# Altium schematic sheet MotorBoard.SchDoc: Set in Document Options » Parameters » Title
size A4; Author: Set in Document Options » Parameters » Author + Contact info
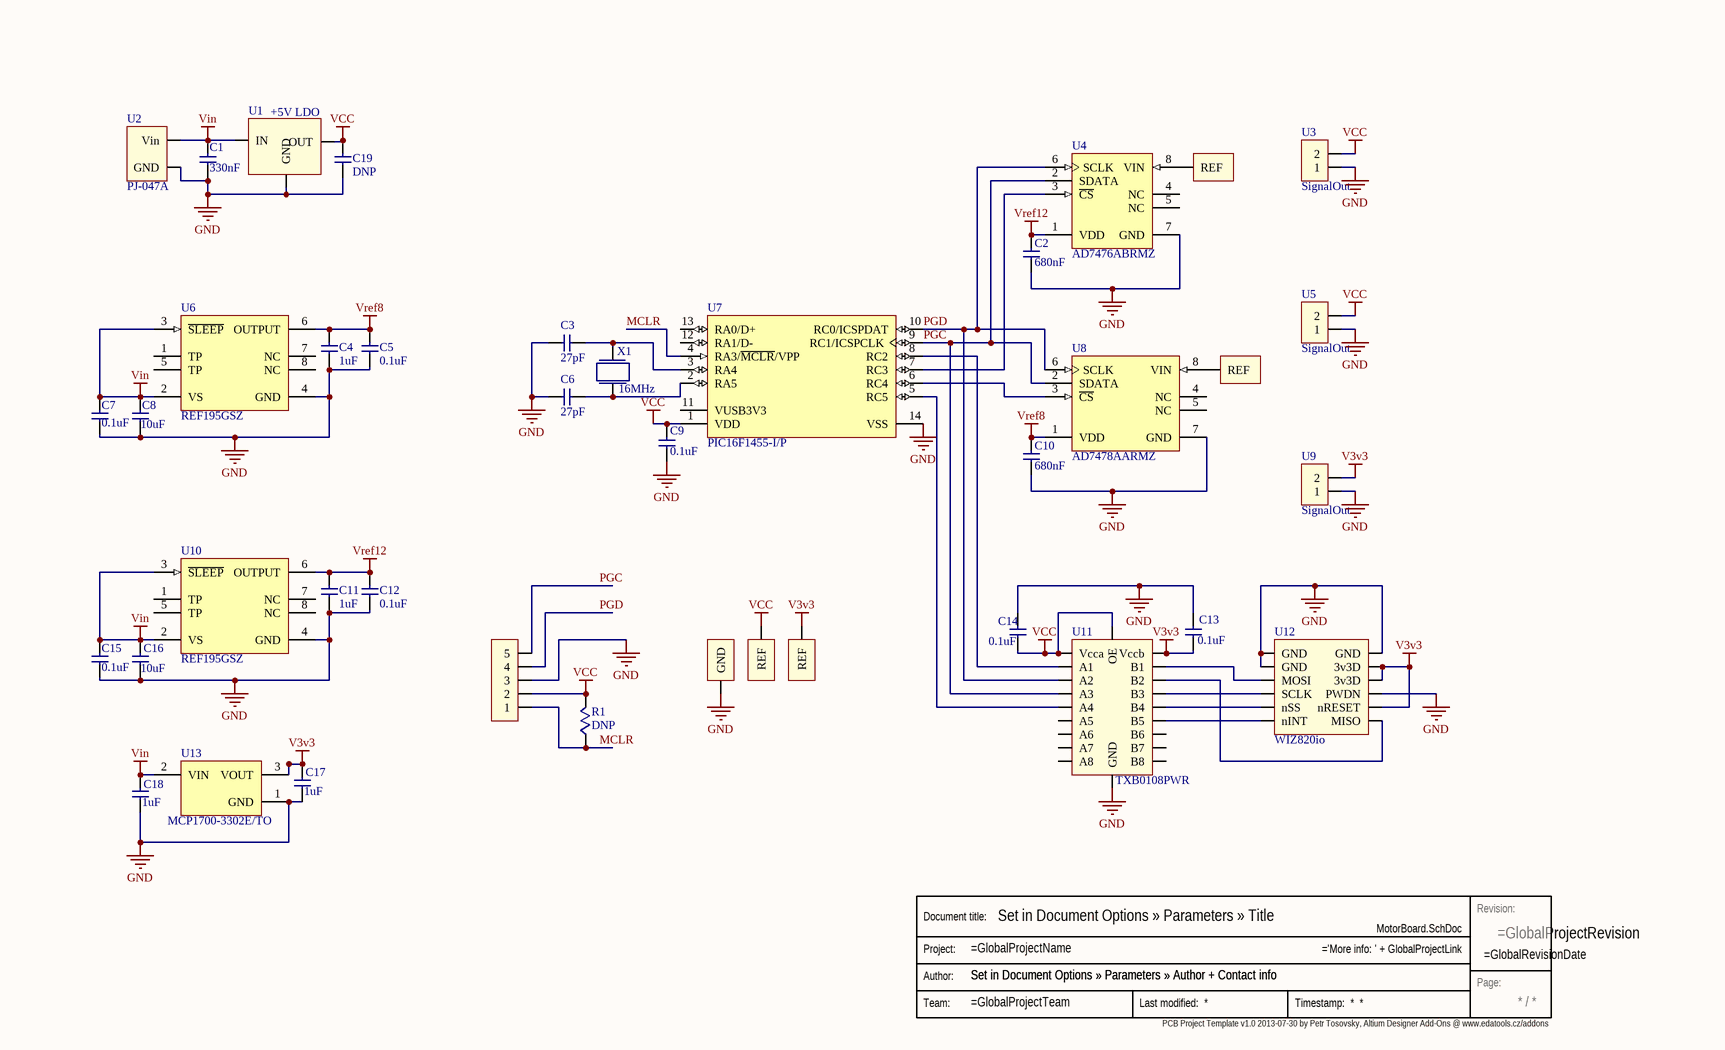
[diagram p0: MotorBoard.SchDoc]

## Parts
C1  330nF  [FK18/24 Capacitor]
C2  680nF  [FK26/16 Capacitor]
C3  27pF  [FK18/24 Capacitor]
C4  1uF  [FK18/24 Capacitor]
C5  0.1uF  [FK26/16 Capacitor]
C6  27pF  [FK18/24 Capacitor]
C7  0.1uF  [FK26/16 Capacitor]
C8  10uF  [FK26/16 Capacitor]
C9  0.1uF  [FK26/16 Capacitor]
C10  680nF  [FK26/16 Capacitor]
C11  1uF  [FK18/24 Capacitor]
C12  0.1uF  [FK26/16 Capacitor]
C13  0.1uF  [FK26/16 Capacitor]
C14  0.1uF  [FK26/16 Capacitor]
C15  0.1uF  [FK26/16 Capacitor]
C16  10uF  [FK26/16 Capacitor]
C17  1uF  [FK18/24 Capacitor]
C18  1uF  [FK18/24 Capacitor]
C19  DNP  [FK26/16 Capacitor]
R1  DNP  [Axial 0.5]
Stamp  Stamp  (value not drawn)  (graphical)
U1  +5V LDO  [MC7805CTG]
U2  PJ-047A  [PJ-047A]
U3  SignalOut  [SignalOut]
U4  AD7476ABRMZ  [RM-8_L]
U5  SignalOut  [SignalOut]
U6  REF195GSZ  [ADI-R-8_L]
U7  PIC16F1455-I/P  [MCHP-PDIP-P14]
U8  AD7478AARMZ  [RM-8_L]
U9  SignalOut  [SignalOut]
U10  REF195GSZ  [ADI-R-8_L]
U11  TXB0108PWR  [TSOP65P640X120-20N]
U12  WIZ820io  [WIZ5200]
U13  MCP1700-3302E/TO  [TO-92-TO3]
U14  Ref  [Ground]  (value not drawn)
U15  Ref  [Ground]  (value not drawn)
U16  Ground  [Ground]  (value not drawn)
U17  ProgrammingHeader  [ProgrammingHeader]  (value not drawn)
U18  Ref  [Ground]  (value not drawn)
U19  Ref  [Ground]  (value not drawn)
X1  16MHz  [9B-16.000MEEJ-B]

## Nets
GND: C1.1 C2.1 C3.1 C4.1 C5.1 C6.1 C7.1 C8.1 C9.1 C10.1 C11.1 C12.1 C13.1 C14.2 C15.1 C16.1 C17.1 C18.1 C19.1 U1.2(GND) U2.2(GND) U3.1 U4.7(GND) U5.1 U6.4(GND) U7.14(VSS) U8.7(GND) U9.1 U10.4(GND) U11.11(GND) U12.1(GND) U12.2(GND) U12.9(PWDN) U12.12(GND) U13.1(GND) U16.1(GND) U17.3
V3v3: C13.2 C17.2 U9.2 U11.19(Vccb) U12.8(nRESET) U12.10(3v3D) U12.11(3v3D) U13.3(VOUT) U15.1(REF)
VCC: C9.2 C14.1 C19.2 R1.2 U1.3(OUT) U3.2 U5.2 U7.1(VDD) U11.2(Vcca) U11.10(OE) U14.1(REF) U17.2
Vin: C1.2 C7.2 C8.2 C15.2 C16.2 C18.2 U1.1(IN) U2.1(Vin) U6.2(VS) U6.3(~{SLEEP}) U10.2(VS) U10.3(~{SLEEP}) U13.2(VIN)
Vref8: C4.2 C5.2 C10.2 U6.6(OUTPUT) U8.1(VDD)
Vref12: C2.2 C11.2 C12.2 U4.1(VDD) U10.6(OUTPUT)
MCLR: R1.1 U7.4(RA3/~{MCLR}/VPP) U17.1
PGC: U4.2(SDATA) U7.9(RC1/ICSPCLK) U8.2(SDATA) U11.4(A3) U17.5
PGD: U4.6(SCLK) U7.10(RC0/ICSPDAT) U8.6(SCLK) U11.3(A2) U17.4
NetC3_2: C3.2 U7.3(RA4) X1.2
NetC6_2: C6.2 U7.2(RA5) X1.1
NetU4_3: U4.3(~{CS}) U7.7(RC3)
NetU4_8: U4.8(VIN) U18.1(REF)
NetU7_5: U7.5(RC5) U11.5(A4)
NetU7_6: U7.6(RC4) U8.3(~{CS})
NetU7_8: U7.8(RC2) U11.1(A1)
NetU8_8: U8.8(VIN) U19.1(REF)
NetU11_15: U11.15(B5) U12.6(nINT)
NetU11_16: U11.16(B4) U12.5(nSS)
NetU11_17: U11.17(B3) U12.4(SCLK)
NetU11_18: U11.18(B2) U12.7(MISO)
NetU11_20: U11.20(B1) U12.3(MOSI)

Not connected (* = marked no-connect by the designer): U4 4(NC) 5(NC); U6 1(TP) 5(TP) 7(NC) 8(NC); U7 11(VUSB3V3) 12(RA1/D-) 13(RA0/D+); U8 4(NC) 5(NC); U10 1(TP) 5(TP) 7(NC) 8(NC); U11 6(A5) 7(A6) 8(A7) 9(A8) 12(B8) 13(B7) 14(B6)

## Notes on the sheet
- PCB Project Template v1.0 2013-07-30 by Petr Tosovsky, Altium Designer Add-Ons @ www.edatools.cz/addons <http://www.edatools.cz/addons>
- (in symbol Stamp) Revision:; Document title:; Project:; Author:; Page:; Team:

## Library data of the parts
C1 = FK24X7R1H334K: CAP CER 0.33UF 50V 10% RADIAL; Manufacturer: TDK Corporation; Capacitance: 0.33µF; Temperature Coefficient: X7R; Supplier 1: Digi-Key; Manufacturer Part Number: FK24X7R1H334K; RoHS: RoHS Compliant; Category: Capacitors; Stock 1: 7845; Pricing 1: 1=0.32, 10=0.222, 100=0.1333, 250=0.11112, 500=0.1, 1000=0.08444, 5000=0.07555, 10000=0.0711, 25000=0.06666 (USD); Packaging: Bulk; Tolerance: ±10%; Voltage - Rated: 50V; Mounting Type: Through Hole; Operating Temperature: -55°C ~ 125°C; Applications: General Purpose; Ratings: -; Package / Case: Radial; Size / Dimension: 0.217" L x 0.177" W (5.50mm x 4.50mm); Height - Seated (Max): 0.217" (5.50mm); Thickness (Max): -; Lead Spacing: 0.197" (5.00mm); Features: -; Lead Style: Formed Leads - Kinked; ComponentLink1URL: http://product.tdk.com/capacitor/leadmlcc/en/documents/leadmlcc_commercial_general_en.pdf; ComponentLink1Description: http://product.tdk.com/capacitor/leadmlcc/en/documents/leadmlcc_commercial_general_en.pdf; Supplier Part Number 1: 445-5263-ND
C2 C10 = FK26X7R1H684K: CAP CER 0.68UF 50V 10% RADIAL; Manufacturer: TDK Corporation; Capacitance: 0.68µF; Temperature Coefficient: X7R; Supplier 1: Digi-Key; Manufacturer Part Number: FK26X7R1H684K; RoHS: RoHS Compliant; Category: Capacitors; Stock 1: 1174; Pricing 1: 1=0.45, 10=0.312, 100=0.187, 250=0.15584, 500=0.14024, 1000=0.11611, 5000=0.10389, 10000=0.09778, 25000=0.09167 (USD); Packaging: Bulk; Tolerance: ±10%; Voltage - Rated: 50V; Mounting Type: Through Hole; Operating Temperature: -55°C ~ 125°C; Applications: General Purpose; Ratings: -; Package / Case: Radial; Size / Dimension: 0.217" L x 0.138" W (5.50mm x 3.50mm); Height - Seated (Max): 0.236" (6.00mm); Thickness (Max): -; Lead Spacing: 0.197" (5.00mm); Features: -; Lead Style: Formed Leads - Kinked; ComponentLink1URL: http://product.tdk.com/capacitor/leadmlcc/en/documents/leadmlcc_commercial_general_en.pdf; ComponentLink1Description: http://product.tdk.com/capacitor/leadmlcc/en/documents/leadmlcc_commercial_general_en.pdf; Supplier Part Number 1: 445-8560-ND
C3 C6 = FK18C0G1H270J: CAP CER 27PF 50V 5% RADIAL; Manufacturer: TDK Corporation; Temperature Coefficient: C0G, NP0; Supplier 1: Digi-Key; Manufacturer Part Number: FK18C0G1H270J; RoHS: RoHS Compliant; Category: Capacitors; Stock 1: 2293; Pricing 1: 1=0.29, 10=0.2, 100=0.1133, 250=0.09, 500=0.08, 1000=0.06999, 5000=0.06166, 10000=0.05833, 25000=0.05333 (USD); Packaging: Bulk; Capacitance: 27pF; Tolerance: ±5%; Voltage - Rated: 50V; Mounting Type: Through Hole; Operating Temperature: -55°C ~ 125°C; Applications: General Purpose; Ratings: -; Package / Case: Radial; Size / Dimension: 0.157" L x 0.098" W (4.00mm x 2.50mm); Height - Seated (Max): 0.217" (5.50mm); Thickness (Max): -; Lead Spacing: 0.098" (2.50mm); Features: -; Lead Style: Formed Leads - Kinked; ComponentLink1URL: http://product.tdk.com/capacitor/leadmlcc/en/documents/leadmlcc_commercial_general_en.pdf; ComponentLink1Description: http://product.tdk.com/capacitor/leadmlcc/en/documents/leadmlcc_commercial_general_en.pdf; Supplier Part Number 1: 445-4764-ND
C4 C11 C17 C18 = FK24X7R1H105K: CAP CER 1UF 50V 10% RADIAL; Manufacturer: TDK Corporation; Capacitance: 1µF; Temperature Coefficient: X7R; Supplier 1: Digi-Key; Manufacturer Part Number: FK24X7R1H105K; RoHS: RoHS Compliant; Category: Capacitors; Stock 1: 21684; Pricing 1: 1=0.4, 10=0.278, 100=0.1667, 250=0.13892, 500=0.12502, 1000=0.10556, 5000=0.09445, 10000=0.0889, 25000=0.08334 (USD); Packaging: Bulk; Tolerance: ±10%; Voltage - Rated: 50V; Mounting Type: Through Hole; Operating Temperature: -55°C ~ 125°C; Applications: General Purpose; Ratings: -; Package / Case: Radial; Size / Dimension: 0.177" L x 0.098" W (4.50mm x 2.50mm); Height - Seated (Max): 0.217" (5.50mm); Thickness (Max): -; Lead Spacing: 0.197" (5.00mm); Features: -; Lead Style: Formed Leads - Kinked; ComponentLink1URL: http://product.tdk.com/capacitor/leadmlcc/en/documents/leadmlcc_commercial_general_en.pdf; ComponentLink1Description: http://product.tdk.com/capacitor/leadmlcc/en/documents/leadmlcc_commercial_general_en.pdf; Supplier Part Number 1: 445-8517-ND
C5 C7 C9 C12-C15 = FK26X7R2A104K: CAP CER 0.1UF 100V 10% RADIAL; Manufacturer: TDK Corporation; Capacitance: 0.1µF; Temperature Coefficient: X7R; Supplier 1: Digi-Key; Manufacturer Part Number: FK26X7R2A104K; RoHS: RoHS Compliant; Category: Capacitors; Stock 1: 28932; Pricing 1: 1=0.44, 10=0.306, 100=0.1833, 250=0.15276, 500=0.1375, 1000=0.11611, 5000=0.10389, 10000=0.09778, 25000=0.09167 (USD); Packaging: Bulk; Tolerance: ±10%; Voltage - Rated: 100V; Mounting Type: Through Hole; Operating Temperature: -55°C ~ 125°C; Applications: General Purpose; Ratings: -; Package / Case: Radial; Size / Dimension: 0.217" L x 0.138" W (5.50mm x 3.50mm); Height - Seated (Max): 0.236" (6.00mm); Thickness (Max): -; Lead Spacing: 0.197" (5.00mm); Features: -; Lead Style: Formed Leads - Kinked; ComponentLink1URL: http://product.tdk.com/capacitor/leadmlcc/en/documents/leadmlcc_commercial_midvoltage_en.pdf; ComponentLink1Description: http://product.tdk.com/capacitor/leadmlcc/en/documents/leadmlcc_commercial_midvoltage_en.pdf; Supplier Part Number 1: 445-2634-ND
C8 C16 = FK16X7R1C106K: CAP CER 10UF 16V 10% RADIAL; Manufacturer: TDK Corporation; Capacitance: 10µF; Temperature Coefficient: X7R; Supplier 1: Digi-Key; Manufacturer Part Number: FK16X7R1C106K; RoHS: RoHS Compliant; Category: Capacitors; Stock 1: 9327; Pricing 1: 1=0.46, 10=0.325, 100=0.2142, 250=0.18248, 500=0.15868, 1000=0.13223, 5000=0.11667, 10000=0.10889, 25000=0.105 (USD); Packaging: Bulk; Tolerance: ±10%; Voltage - Rated: 16V; Mounting Type: Through Hole; Operating Temperature: -55°C ~ 125°C; Applications: General Purpose; Ratings: -; Package / Case: Radial; Size / Dimension: 0.217" L x 0.138" W (5.50mm x 3.50mm); Height - Seated (Max): 0.236" (6.00mm); Thickness (Max): -; Lead Spacing: 0.098" (2.50mm); Features: -; Lead Style: Formed Leads - Kinked; ComponentLink1URL: http://product.tdk.com/capacitor/leadmlcc/en/documents/leadmlcc_commercial_general_en.pdf; ComponentLink1Description: http://product.tdk.com/capacitor/leadmlcc/en/documents/leadmlcc_commercial_general_en.pdf; Supplier Part Number 1: 445-8348-ND
C19 = DNP Cap
R1 = DNP Res
U1 = MC7805CTG: IC REG LDO 5V 1A TO220AB; Manufacturer: ON Semiconductor; Regulator Topology: Positive Fixed; Voltage - Dropout (Typical): 2V @ 1A; Number of Regulators: 1; Voltage - Input: Up to 35V; Supplier 1: Digi-Key; Manufacturer Part Number: MC7805CTG; RoHS: RoHS Compliant; Category: Integrated Circuits (ICs); Stock 1: 2903; Pricing 1: 1=0.49, 10=0.414, 25=0.3624, 100=0.3105, 250=0.26912, 500=0.2277, 1000=0.17595, 2500=0.16042, 5000=0.15008 (USD); Packaging: Tube; Voltage - Output: 5V; Current - Output: 1A; Current - Limit (Min): -; Operating Temperature: 0°C ~ 125°C; Mounting Type: Through Hole; Package / Case: TO-220-3; Supplier Device Package: TO-220AB; ComponentLink1URL: http://www.onsemi.com/pub_link/Collateral/MC7800-D.PDF; ComponentLink1Description: http://www.onsemi.com/pub_link/Collateral/MC7800-D.PDF; Supplier Part Number 1: MC7805CTGOS-ND
U2 = PJ-047A: CON PWR JCK 2.0 X 6.0MM W/SHLD; Manufacturer: CUI Inc; Connector Type: Jack; Gender: Male; Plug/Mating Plug Diameter: 2.1mm ID, 5.5mm OD; Number of Positions/Contacts: 2 Conductors, 3 Contacts; Internal Switch(s): Single Switch, Normally Closed; Shielding: Shielded; Voltage - Rated: 16VDC; Current Rating: 2.5A; Supplier 1: Digi-Key; Manufacturer Part Number: PJ-047A; RoHS: RoHS Compliant; Category: Connectors, Interconnects; Stock 1: 7767; Pricing 1: 1=0.97, 10=0.752, 100=0.5738, 500=0.459, 1000=0.408, 2500=0.33915 (USD); Mounting Type: Through Hole, Right Angle; Termination: Solder; Features: Board Guide; Color: Black; Contact Material: Brass; Contact Material - Plating: Nickel; Housing Color: Black; Housing Material: Thermoplastic; Operating Temperature: -25°C ~ 85°C; ComponentLink1URL: http://www.cui.com/product/resource/digikeypdf/pj-047a.pdf; ComponentLink1Description: http://www.cui.com/product/resource/digikeypdf/pj-047a.pdf; Supplier Part Number 1: CP-047A-ND
U4 = AD7476ABRMZ: Single 12-Bit Analog-to-Digital Converter with Serial, SPI Interface, 2.35 to 5.25 V, 1MSPS, -40 to +85 degC, RM-8, Pb-Free, Tube; Manufacturer: Analog Devices; Resolution (Bits): 12; Channels: 1; Throughput Rate (SPS): 1M; Interface: Ser, SPI; Automotive Qualified: Yes; DatasheetVersion: Rev.F; PackageVersion: Aug-2005; PackageReference: RM-8; PackageDescription: 8-Lead Mini Small Outline Package [MSOP]; Supplier 1: Digi-Key; Supplier Part Number 1: AD7476ABRMZ-ND; Supplier 2: Farnell; Supplier Part Number 2: 1581903; Supplier 3: Newark; Supplier Part Number 3: 15P0808; Supplier 4: Newark; Supplier Part Number 4: 59K4895; Supplier 5: Mouser; Supplier Part Number 5: 584-AD7476ABRMZ; RoHS: Y; Generic Part Number: AD7476A; Packing: Tube; Mounting Technology: Surface Mount; Code_JEDEC: MO-187-AA; PartNumber: AD7476ABRMZ; ComponentLink1Description: Manufacturer URL; ComponentLink1URL: http://www.analog.com/en/index.html; ComponentLink2Description: Datasheet; ComponentLink2URL: http://www.analog.com/static/imported-files/data_sheets/AD7476A_7477A_7478A.pdf; ComponentLink3Description: Package Specification; ComponentLink3URL: http://www.analog.com/static/imported-files/packages/PKG_PDF/MSOP%28RM%29/RM_8.pdf; ComponentLink4Description: Product URL; ComponentLink4URL: http://www.analog.com/en/analog-to-digital-converters/ad-converters/ad7476a/products/product.html
U6 U10 = REF195GSZ: Precision Micropower, Low Dropout Voltage Reference, 5 V Output, 5.1 to 15 V Supply, Industrial, 8-pin SOIC (R-8), Tube; Manufacturer: Analog Devices; Ref Out TC (ppm/C): 10; Vout: 5V; DatasheetVersion: Rev. L; PackageVersion: 060506-A, 06/2006; PackageReference: R-8; PackageDescription: 8-Pin Standard Small Outline Package, Body 4.9 x 3.9 mm, Pitch 1.27 mm; Supplier 1: Digi-Key; Supplier Part Number 1: REF195GSZ-ND; Supplier 2: Newark; Supplier Part Number 2: 59K9052; Supplier 3: Mouser; Supplier Part Number 3: 584-REF195GSZ; Packing: Tube; Operating Temp Range: -40 to 85 degC; Mounting Technology: Surface Mount; Code_JEDEC: MS-012-AA; PartNumber: REF195GSZ; ComponentLink1Description: Manufacturer URL; ComponentLink1URL: http://www.analog.com/en/index.html; ComponentLink2Description: Datasheet; ComponentLink2URL: http://www.analog.com/static/imported-files/data_sheets/REF19xSeries.pdf; ComponentLink3Description: Package Specification; ComponentLink3URL: http://www.analog.com/static/imported-files/packages/PKG_PDF/SOIC_Narrow%20(R)/R_8.pdf; ComponentLink4Description: URL Link1; ComponentLink4URL: Product URL:http://www.analog.com/en/special-linear-functions/voltage-references/ref195/products/product.html
U7 = PIC16F1455-I/P: 8-Bit Flash USB Microcontroller with XLP Technology, 48 MHz, 11 I/O, -40 to 85 degC, 14-pin PDIP (P14), Tube; Manufacturer: Microchip; # of A/D Channels: 5; Digital Communication: 1 -A/E/USART, 1 -MSSP(SPI/I2C); I/O Pins: 11; Max. CPU Speed MHz: 48; Operation Voltage Range: 2.3V - 5.5V; Program Memory KBytes: 14; Program Memory KWords: 8; RAM: 1024; Timers: 2 - 8-bit, 1 - 16-bit, 0 - 32-bit; DatasheetVersion: Rev. A; PackageVersion: C04-005B, 12/2012; PackageReference: PDIP-P14; PackageDescription: 14-Lead Plastic Dual In-Line, 6.6 x 19.18 mm Body, 2.54 mm Pitch; Supplier 1: Digi-Key; Supplier Part Number 1: PIC16F1455-I/P-ND; Supplier 2: Farnell; Supplier Part Number 2: 2305813; Supplier 3: Newark; Supplier Part Number 3: 83T7199; Supplier 4: Mouser; Supplier Part Number 4: 579-PIC16F1455-I/P; Memory Type: Flash; Packing: TUBE; RoHS: TRUE; Mounting Technology: Through Hole; PartNumber: PIC16F1455-I/P; ComponentLink1Description: Datasheet; ComponentLink1URL: http://ww1.microchip.com/downloads/en/DeviceDoc/41639A.pdf; ComponentLink2Description: Package Specification; ComponentLink2URL: http://www.microchip.com/stellent/groups/techpub_sg/documents/packagingspec/en012702.pdf; ComponentLink3Description: URL Link1; ComponentLink3URL: Product URL:http://www.microchip.com/datasheet/PIC16F1455
U8 = AD7478AARMZ: Single 8-Bit Analog-to-Digital Converter with Serial, SPI Interface,2.35 V, 1.2MSPS, -40 to +85 degC, RM-8, Pb-Free, Tube; Manufacturer: Analog Devices; Resolution (Bits): 8; Channels: 1; Throughput Rate (SPS): 1.2M; Interface: Ser, SPI; Automotive Qualified: Yes; DatasheetVersion: Rev.F; PackageVersion: Aug-2005; PackageReference: RM-8; PackageDescription: 8-Lead Mini Small Outline Package [MSOP]; Supplier 1: Digi-Key; Supplier Part Number 1: AD7478AARMZ-ND; Supplier 2: Farnell; Supplier Part Number 2: 9426353; Supplier 3: Newark; Supplier Part Number 3: 31M4267; Supplier 4: Newark; Supplier Part Number 4: 19M0869; Supplier 5: Mouser; Supplier Part Number 5: 584-AD7478AARMZ; RoHS: Y; Generic Part Number: AD7478A; Packing: Tube; Mounting Technology: Surface Mount; Code_JEDEC: MO-187-AA; PartNumber: AD7478AARMZ; ComponentLink1Description: Manufacturer URL; ComponentLink1URL: http://www.analog.com/en/index.html; ComponentLink2Description: Datasheet; ComponentLink2URL: http://www.analog.com/static/imported-files/data_sheets/AD7476A_7477A_7478A.pdf; ComponentLink3Description: Package Specification; ComponentLink3URL: http://www.analog.com/static/imported-files/packages/PKG_PDF/MSOP%28RM%29/RM_8.pdf; ComponentLink4Description: Product URL; ComponentLink4URL: http://www.analog.com/en/analog-to-digital-converters/ad-converters/ad7478a/products/product.html
U11 = TXB0108PWR: IC 8-BIT TRNSTR 15KV ESD 20TSSOP; Manufacturer: Texas Instruments; Logic Function: Translator, Bidirectional; Number of Bits: 8; Input Type: Logic; Data Rate: 100Mbps; Number of Outputs/Channel: 1; Differential - Input:Output: No/No; Propagation Delay (Max): 4ns; Voltage - Supply: 1.2 V ~ 3.6 V, 1.65 V ~ 5.5 V; Supplier 1: Digi-Key; Manufacturer Part Number: TXB0108PWR; RoHS: RoHS Compliant; Category: Integrated Circuits (ICs); Stock 1: 13276; Pricing 1: 1=2.3, 10=2.074, 25=1.8576, 100=1.6704, 250=1.4832, 500=1.296, 750=1.1736, 1000=0.9 (USD); Packaging: Cut Tape (CT); Output Type: Logic; Number of Channels: 8; Operating Temperature: -40°C ~ 85°C; Package / Case: 20-TSSOP (0.173", 4.40mm Width); Supplier Device Package: 20-TSSOP; Mounting Type: Surface Mount; ComponentLink1URL: http://www.ti.com/lit/ds/symlink/txb0108.pdf; ComponentLink1Description: http://www.ti.com/lit/ds/symlink/txb0108.pdf; Supplier Part Number 1: 296-21527-1-ND
U12 = WIZ820io: Ethernet Modules W5200 & MAG JACK ioPLATFORM MODULE; Manufacturer: WIZnet; Description/Function: Plug-in network module; Interface Type: SPI; Number of Ports: 1 Ethernet; Operating Supply Voltage: 3.3 V; Supplier 1: Mouser; Manufacturer Part Number: WIZ820io; RoHS: RoHS Compliant; Category: Ethernet Modules; Stock 1: 175; Pricing 1: 1=28.07, 50=26.85, 100=26.11, 250=25.41 (AUD); Dimensions: 23 mm x 25 mm; Processor Type: W5200; Product: Serial to Ethernet Modules; Brand: WIZnet; Maximum Operating Temperature: + 85 C; Minimum Operating Temperature: - 40 C; RoHS - Mouser: Y; Minimum Order Quantity: 1; Reeling: False; ComponentLink1URL: http://www.mouser.com/ds/2/443/WIZ820io_User_Manual_V1.0-268459.pdf; ComponentLink1Description: http://www.mouser.com/ds/2/443/WIZ820io_User_Manual_V1.0-268459.pdf; Supplier Part Number 1: 950-WIZ820IO
U13 = MCP1700-3302E/TO: Low Quiescent Current LDO, 3-Pin TO-92, Extended TemperatureBAG; Manufacturer: Microchip; DatasheetVersion: revB, Feb-2007; PackageVersion: revBB, Aug-2009; PackageReference: TO-92-TO3; PackageDescription: 3-Lead Plastic Transistor Outline (TO) [TO-92]; Supplier 1: Digi-Key; Supplier Part Number 1: MCP1700-3302E/TO-ND; Supplier 2: Farnell; Supplier Part Number 2: 1296588; Supplier 3: Newark; Supplier Part Number 3: 88H9804; Supplier 4: Mouser; Supplier Part Number 4: 579-MCP1700-3302E/TO; Mounting Technology: Through Hole; PartNumber: MCP1700-3302E/TO; ComponentLink1Description: Manufacturer URL; ComponentLink1URL: http://www.microchip.com/; ComponentLink2Description: Datasheet; ComponentLink2URL: http://ww1.microchip.com/downloads/en/DeviceDoc/21826b.pdf; ComponentLink3Description: Package Specification; ComponentLink3URL: http://www.microchip.com/stellent/groups/techpub_sg/documents/packagingspec/en012702.pdf
X1 = 9B-16.000MEEJ-B: CRYSTAL 16MHZ 18PF THRU; Manufacturer: TXC CORPORATION; Frequency Stability: ±10ppm; ESR (Equivalent Series Resistance): 30 Ohm; Operating Mode: Fundamental; Supplier 1: Digi-Key; Manufacturer Part Number: 9B-16.000MEEJ-B; RoHS: RoHS Compliant; Category: Crystals and Oscillators; Stock 1: 1815; Pricing 1: 1=0.48, 10=0.4, 50=0.36, 100=0.32, 500=0.304, 1000=0.256, 2500=0.24, 5000=0.232, 10000=0.224 (USD); Packaging: Bulk; Type: MHz Crystal; Frequency: 16MHz; Frequency Tolerance: ±10ppm; Load Capacitance: 18pF; Operating Temperature: -20°C ~ 70°C; Ratings: -; Mounting Type: Through Hole; Package / Case: HC49/US; Size / Dimension: 0.453" L x 0.197" W (11.50mm x 5.00mm); Height: 0.145" (3.68mm); ComponentLink1URL: http://www.txccrystal.com/images/pdf/9b-accuracy.pdf; ComponentLink1Description: http://www.txccrystal.com/images/pdf/9b-accuracy.pdf; Supplier Part Number 1: 887-1244-ND